# EAGLE design Emmelie-v3.2 (EAGLE 9.4.2)

## Sheet 1 of 3
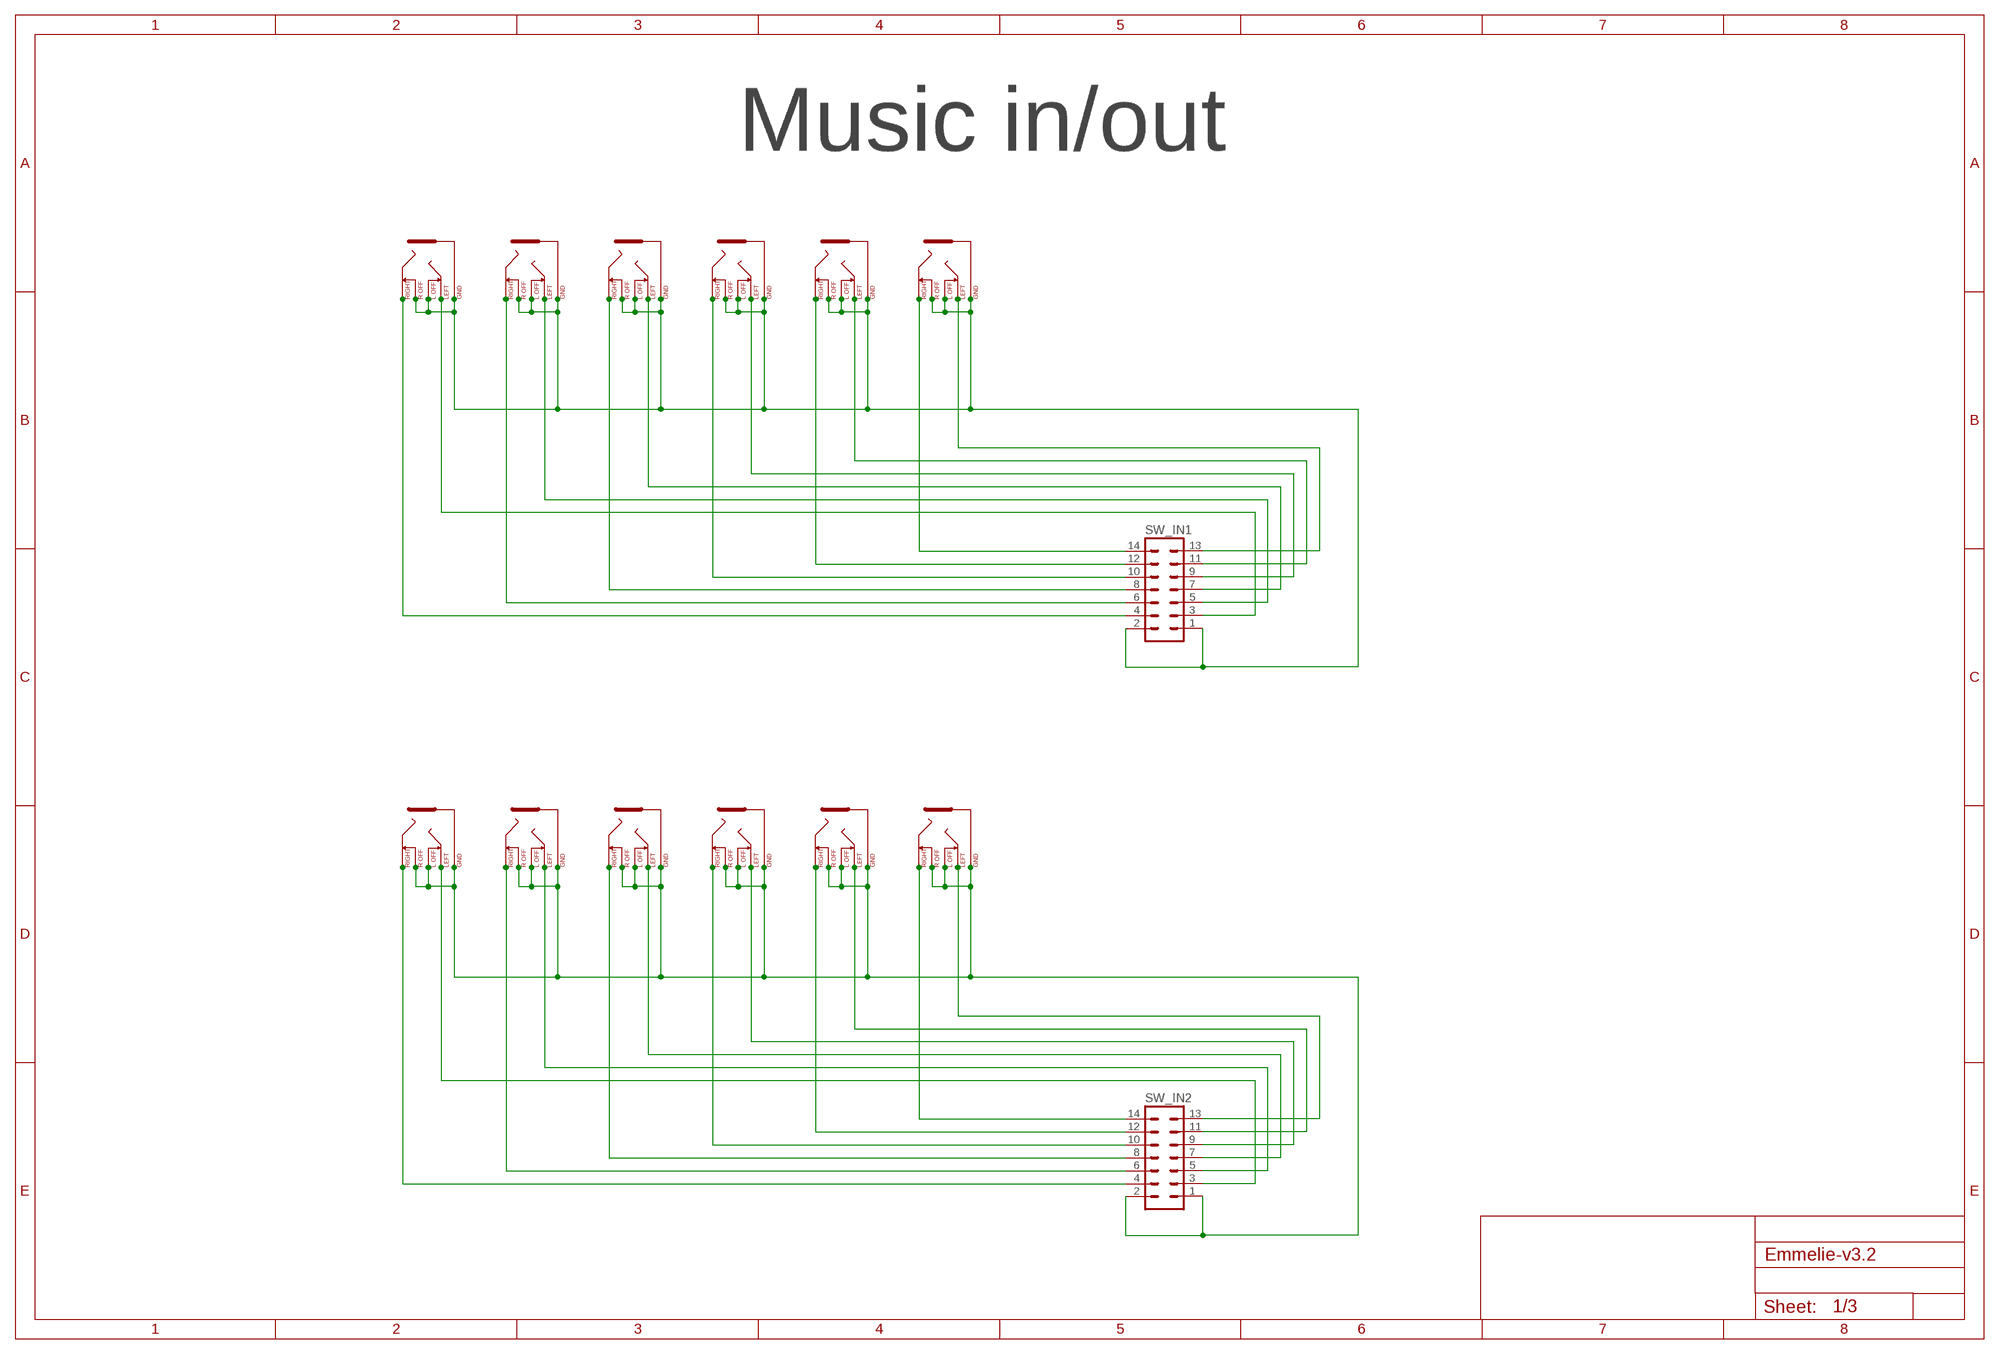
[diagram p0: schematic, sheet 1]

### Parts
SW_IN1  ML14  [ML14]
SW_IN2  ML14  [ML14]
U$1  KLINKE3,5  [KLINKE3,5]
U$2  KLINKE3,5  [KLINKE3,5]
U$3  KLINKE3,5  [KLINKE3,5]
U$4  KLINKE3,5  [KLINKE3,5]
U$5  KLINKE3,5  [KLINKE3,5]
U$6  KLINKE3,5  [KLINKE3,5]
U$7  KLINKE3,5  [KLINKE3,5]
U$8  KLINKE3,5  [KLINKE3,5]
U$9  KLINKE3,5  [KLINKE3,5]
U$10  KLINKE3,5  [KLINKE3,5]
U$11  KLINKE3,5  [KLINKE3,5]
U$12  KLINKE3,5  [KLINKE3,5]

### Nets
KLINKE_IN_0V: SW_IN2.1 SW_IN2.2 U$7.GND U$7.LEFT_OFF U$7.RIGHT_OFF U$8.GND U$8.LEFT_OFF U$8.RIGHT_OFF U$9.GND U$9.LEFT_OFF U$9.RIGHT_OFF U$10.GND U$10.LEFT_OFF U$10.RIGHT_OFF U$11.GND U$11.LEFT_OFF U$11.RIGHT_OFF U$12.GND U$12.LEFT_OFF U$12.RIGHT_OFF
KLINKE_OUT_0V: SW_IN1.1 SW_IN1.2 U$1.GND U$1.LEFT_OFF U$1.RIGHT_OFF U$2.GND U$2.LEFT_OFF U$2.RIGHT_OFF U$3.GND U$3.LEFT_OFF U$3.RIGHT_OFF U$4.GND U$4.LEFT_OFF U$4.RIGHT_OFF U$5.GND U$5.LEFT_OFF U$5.RIGHT_OFF U$6.GND U$6.LEFT_OFF U$6.RIGHT_OFF
N$27: SW_IN1.4 U$1.RIGHT
N$33: SW_IN1.6 U$2.RIGHT
N$34: SW_IN1.8 U$3.RIGHT
N$37: SW_IN1.10 U$4.RIGHT
N$38: SW_IN1.12 U$5.RIGHT
N$39: SW_IN1.14 U$6.RIGHT
N$40: SW_IN1.3 U$1.LEFT
N$41: SW_IN1.5 U$2.LEFT
N$42: SW_IN1.7 U$3.LEFT
N$43: SW_IN1.9 U$4.LEFT
N$44: SW_IN1.11 U$5.LEFT
N$45: SW_IN1.13 U$6.LEFT
N$46: SW_IN2.4 U$7.RIGHT
N$48: SW_IN2.6 U$8.RIGHT
N$49: SW_IN2.8 U$9.RIGHT
N$50: SW_IN2.10 U$10.RIGHT
N$51: SW_IN2.12 U$11.RIGHT
N$52: SW_IN2.14 U$12.RIGHT
N$53: SW_IN2.3 U$7.LEFT
N$54: SW_IN2.5 U$8.LEFT
N$55: SW_IN2.7 U$9.LEFT
N$61: SW_IN2.9 U$10.LEFT
N$62: SW_IN2.11 U$11.LEFT
N$87: SW_IN2.13 U$12.LEFT

### Notes on the sheet
- Music in/out

## Sheet 2 of 3
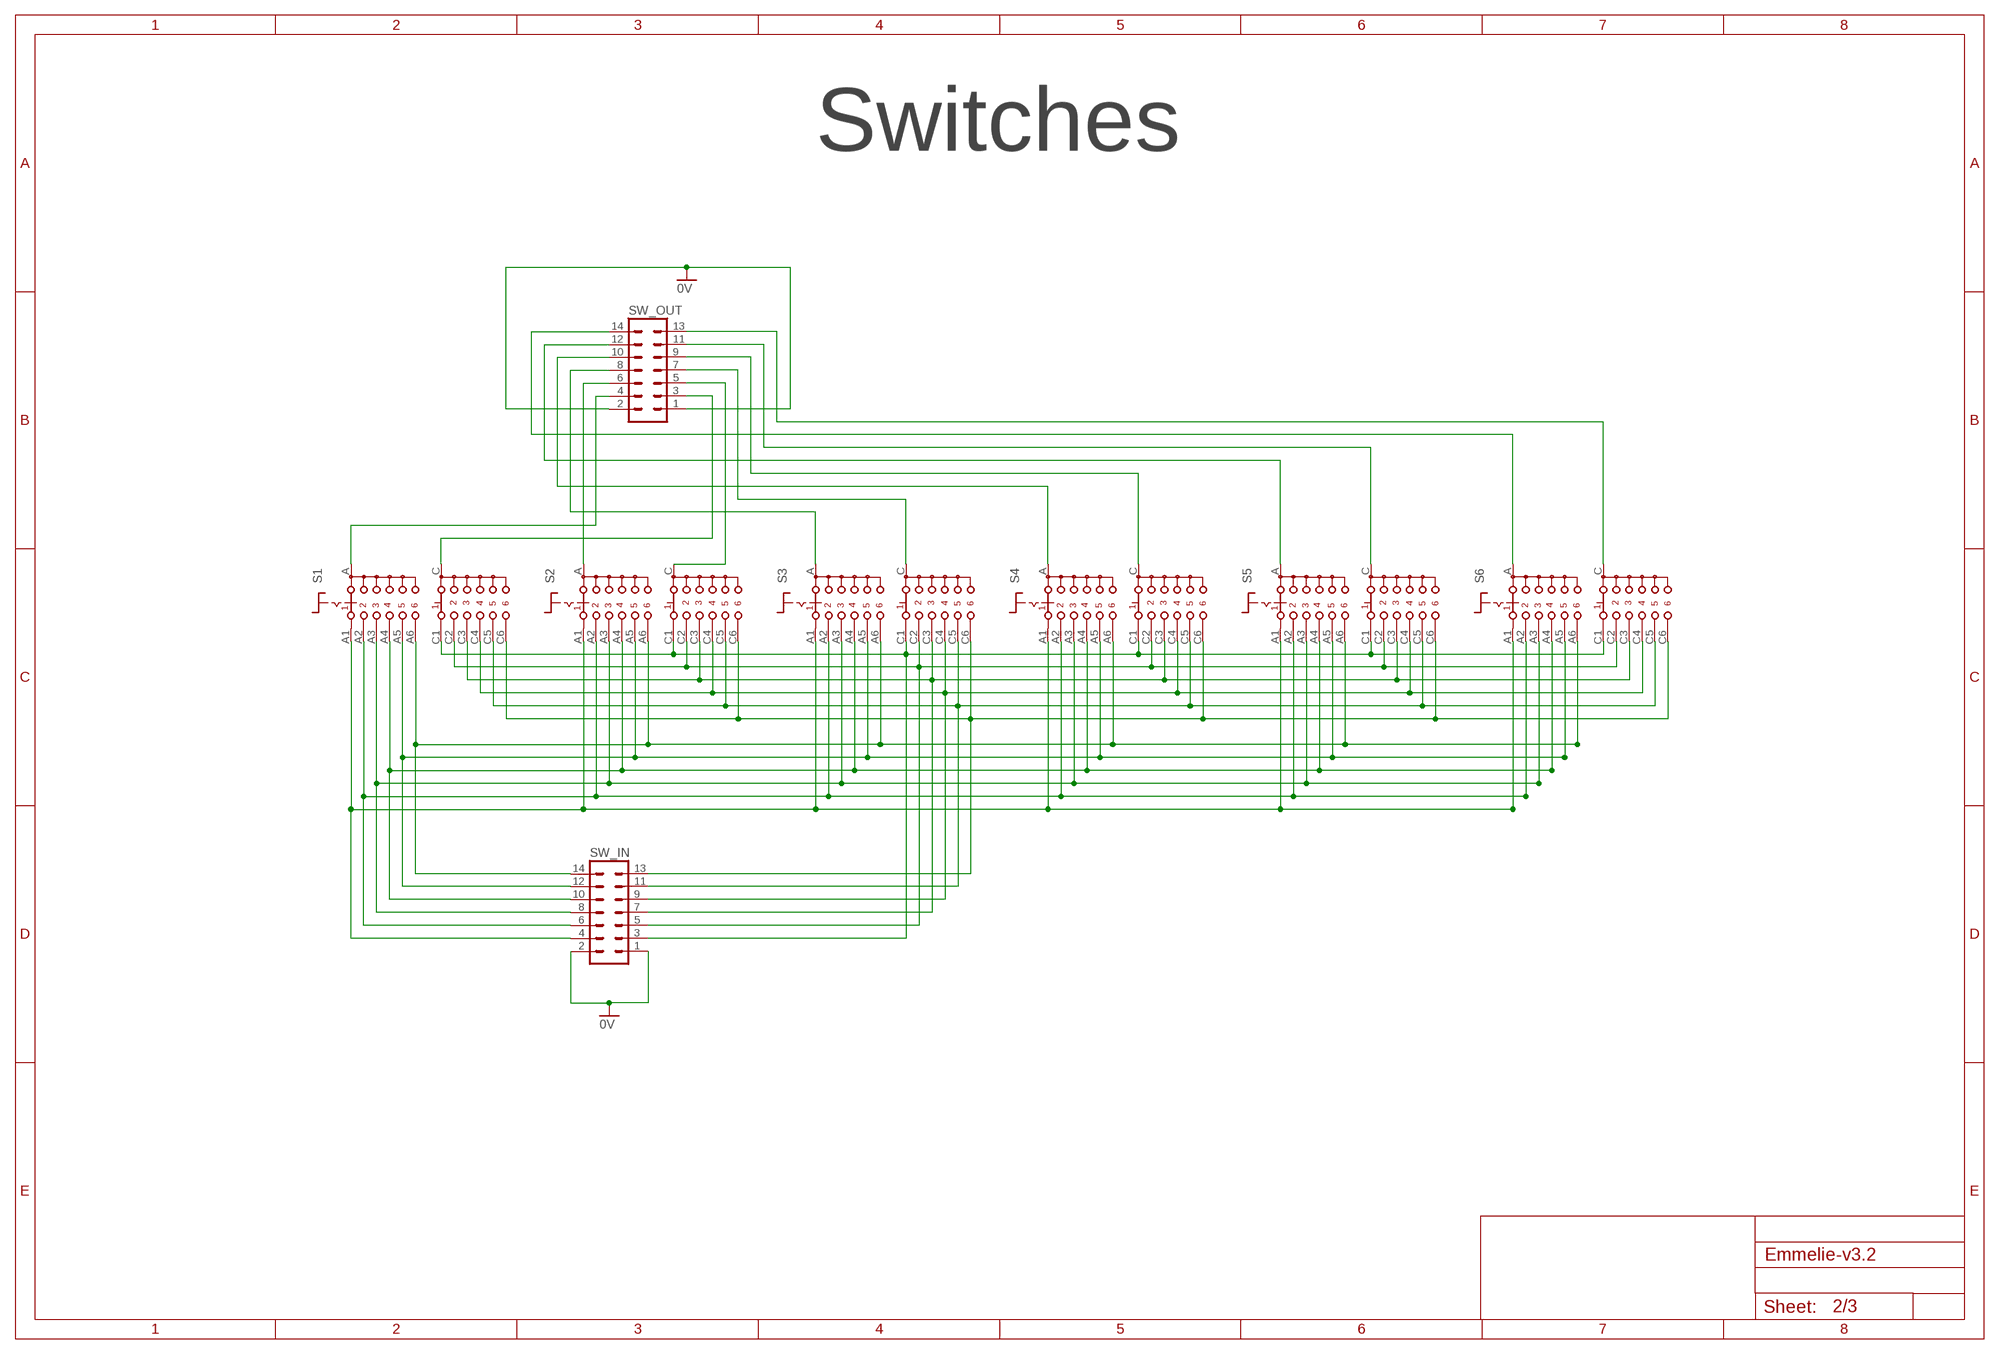
[diagram p1: schematic, sheet 2]

### Parts
S1  CK102X06  [CK102X06]
S2  CK102X06  [CK102X06]
S3  CK102X06  [CK102X06]
S4  CK102X06  [CK102X06]
S5  CK102X06  [CK102X06]
S6  CK102X06  [CK102X06]
SW_IN  ML14  [ML14]
SW_OUT  ML14  [ML14]

### Nets
N$1: S1.A1 S2.A1 S3.A1 S4.A1 S5.A1 S6.A1 SW_IN.4
N$2: S1.A2 S2.A2 S3.A2 S4.A2 S5.A2 S6.A2 SW_IN.6
N$3: S1.A3 S2.A3 S3.A3 S4.A3 S5.A3 S6.A3 SW_IN.8
N$4: S1.A4 S2.A4 S3.A4 S4.A4 S5.A4 S6.A4 SW_IN.10
N$5: S1.A5 S2.A5 S3.A5 S4.A5 S5.A5 S6.A5 SW_IN.12
N$6: S1.A6 S2.A6 S3.A6 S4.A6 S5.A6 S6.A6 SW_IN.14
N$7: S1.C SW_OUT.3
N$8: S1.A SW_OUT.4
N$9: S2.A SW_OUT.6
N$10: S2.C SW_OUT.5
N$11: S3.A SW_OUT.8
N$12: S3.C SW_OUT.7
N$19: S4.A SW_OUT.10
N$20: S4.C SW_OUT.9
N$21: S5.A SW_OUT.12
N$22: S5.C SW_OUT.11
N$23: S6.A SW_OUT.14
N$24: S6.C SW_OUT.13
N$25: S1.C1 S2.C1 S3.C1 S4.C1 S5.C1 S6.C1 SW_IN.3
N$56: S1.C2 S2.C2 S3.C2 S4.C2 S5.C2 S6.C2 SW_IN.5
N$57: S1.C3 S2.C3 S3.C3 S4.C3 S5.C3 S6.C3 SW_IN.7
N$58: S1.C4 S2.C4 S3.C4 S4.C4 S5.C4 S6.C4 SW_IN.9
N$59: S1.C5 S2.C5 S3.C5 S4.C5 S5.C5 S6.C5 SW_IN.11
N$60: S1.C6 S2.C6 S3.C6 S4.C6 S5.C6 S6.C6 SW_IN.13
SCHALTER_0V: SW_IN.1 SW_IN.2 SW_OUT.1 SW_OUT.2 ; supply symbol labelled 0V

### Notes on the sheet
- Switches

## Sheet 3 of 3
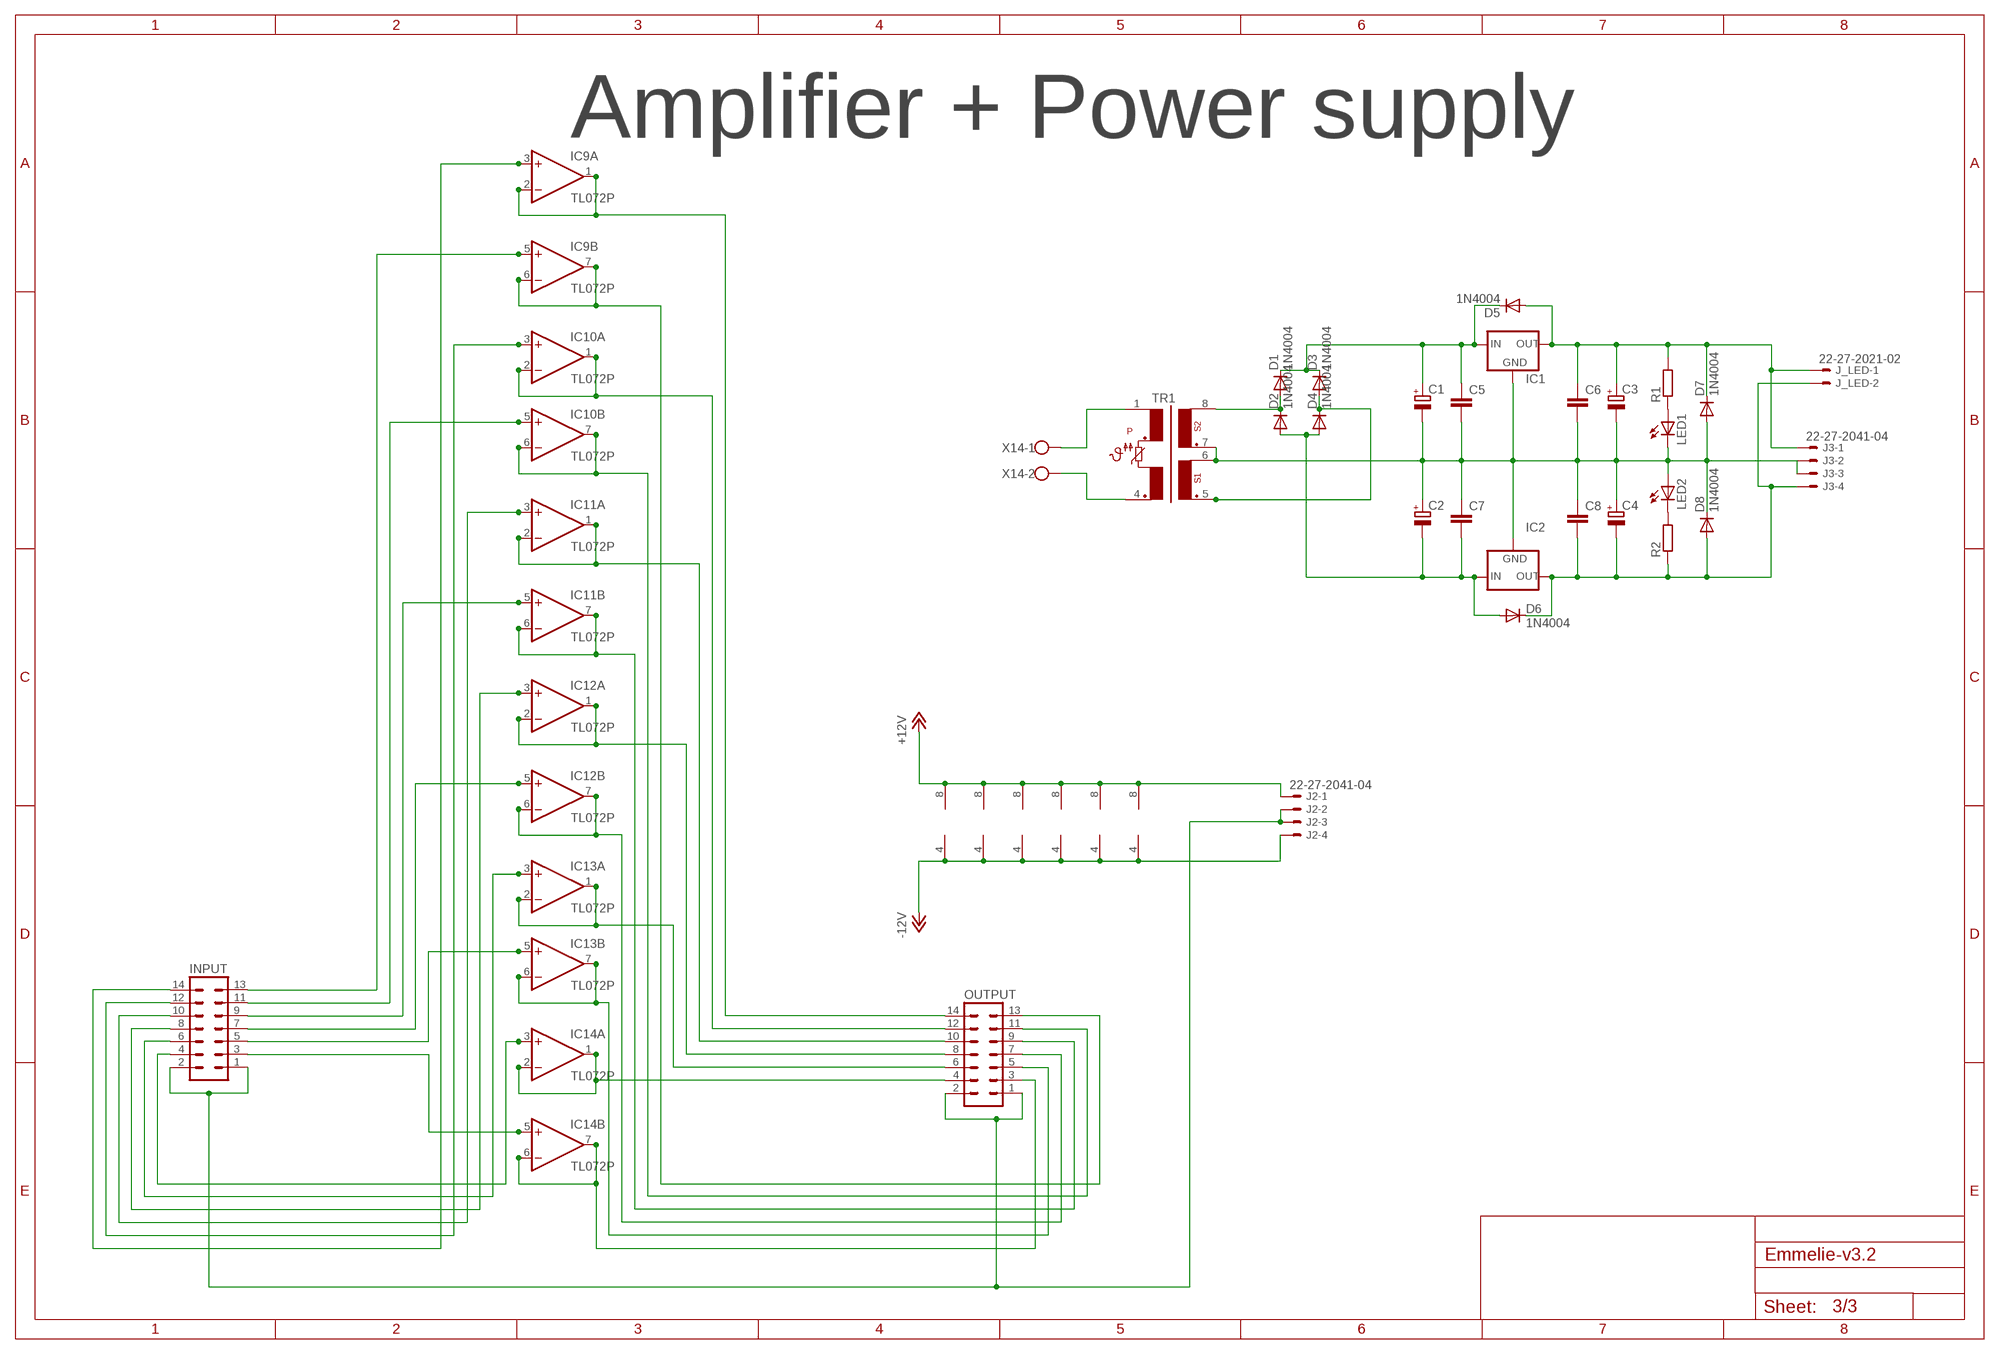
[diagram p2: schematic, sheet 3]

### Parts
C1  CPOL-EUE5-13  [E5-13]
C2  CPOL-EUE5-13  [E5-13]
C3  CPOL-EUE2.5-7  [E2,5-7]
C4  CPOL-EUE2.5-7  [E2,5-7]
C5  C-EU050-075X075  [C050-075X075]
C6  C-EU050-075X075  [C050-075X075]
C7  C-EU050-075X075  [C050-075X075]
C8  C-EU050-075X075  [C050-075X075]
D1  1N4004  [DO41-10]
D2  1N4004  [DO41-10]
D3  1N4004  [DO41-10]
D4  1N4004  [DO41-10]
D5  1N4004  [DO41-10]
D6  1N4004  [DO41-10]
D7  1N4004  [DO41-10]
D8  1N4004  [DO41-10]
IC1  78XXS  [78XXS]
IC2  79XXS  [79XXS]
IC9  TL072P  [DIL08]
IC10  TL072P  [DIL08]
IC11  TL072P  [DIL08]
IC12  TL072P  [DIL08]
IC13  TL072P  [DIL08]
IC14  TL072P  [DIL08]
INPUT  ML14  [ML14]
J2  22-27-2041-04  [6410-04]
J3  22-27-2041-04  [6410-04]
J_LED  22-27-2021-02  [6410-02]
LED1  LED5MM  [LED5MM]
LED2  LED5MM  [LED5MM]
OUTPUT  ML14  [ML14]
R1  R-EU_0207/15  [0207/15]
R2  R-EU_0207/15  [0207/15]
TR1  FLE04-06  [FLE04-06]
X14  W237-02P  [W237-132]

### Nets
+12V: IC9.8(P:V+) IC10.8(P:V+) IC11.8(P:V+) IC12.8(P:V+) IC13.8(P:V+) IC14.8(P:V+) J2.1
-12V: IC9.4(P:V-) IC10.4(P:V-) IC11.4(P:V-) IC12.4(P:V-) IC13.4(P:V-) IC14.4(P:V-) J2.4
N$13: C2.- C7.2 D2.A D4.A D6.A IC2.IN
N$14: D3.A D4.C TR1.5
N$16: C1.+ C5.1 D1.C D3.C D5.C IC1.IN
N$18: LED1.A R1.1
N$26: LED2.K(C) R2.2
N$31: TR1.1 X14.1
N$32: D1.A D2.C TR1.8
N$35: C3.+ C6.1 D5.A D7.C IC1.OUT J3.1 J_LED.1 R1.2
N$36: C4.- C8.2 D6.C D8.A IC2.OUT J3.4 J_LED.2 R2.1
N$63: IC14.5(B:+IN) INPUT.3
N$64: IC14.3(A:+IN) INPUT.4
N$65: IC13.3(A:+IN) INPUT.6
N$66: IC12.3(A:+IN) INPUT.8
N$67: IC9.3(A:+IN) INPUT.14
N$68: IC12.5(B:+IN) INPUT.7
N$69: IC10.3(A:+IN) INPUT.12
N$70: IC13.5(B:+IN) INPUT.5
N$71: IC11.5(B:+IN) INPUT.9
N$72: IC11.3(A:+IN) INPUT.10
N$73: IC10.5(B:+IN) INPUT.11
N$74: IC9.5(B:+IN) INPUT.13
N$75: IC14.6(B:-IN) IC14.7(B:OUT) OUTPUT.3
N$76: IC14.1(A:OUT) IC14.2(A:-IN) OUTPUT.4
N$77: IC13.6(B:-IN) IC13.7(B:OUT) OUTPUT.5
N$78: IC13.1(A:OUT) IC13.2(A:-IN) OUTPUT.6
N$79: IC12.6(B:-IN) IC12.7(B:OUT) OUTPUT.7
N$80: IC12.1(A:OUT) IC12.2(A:-IN) OUTPUT.8
N$81: IC11.6(B:-IN) IC11.7(B:OUT) OUTPUT.9
N$82: IC11.1(A:OUT) IC11.2(A:-IN) OUTPUT.10
N$83: IC10.6(B:-IN) IC10.7(B:OUT) OUTPUT.11
N$84: IC10.1(A:OUT) IC10.2(A:-IN) OUTPUT.12
N$85: IC9.6(B:-IN) IC9.7(B:OUT) OUTPUT.13
N$86: IC9.1(A:OUT) IC9.2(A:-IN) OUTPUT.14
N$89: TR1.4 X14.2
NETZ_0V: C1.- C2.+ C3.- C4.+ C5.2 C6.2 C7.1 C8.1 D7.A D8.C IC1.GND IC2.GND J3.2 J3.3 LED1.K(C) LED2.A TR1.6 TR1.7
OPV_0V: INPUT.1 INPUT.2 J2.2 J2.3 OUTPUT.1 OUTPUT.2

### Notes on the sheet
- Amplifier + Power supply

## Library data of the parts
C1 C2 = resistor:CPOL-EU: POLARIZED CAPACITOR, European symbol
C3 C4 = rcl:CPOL-EU: POLARIZED CAPACITOR, European symbol
C5-C8 = resistor:C-EU: CAPACITOR, European symbol
D1-D8 = diode:1N4004: DIODE general purpose rectifier, 1 A
IC1 = v-reg:78XXS: VOLTAGE REGULATOR
IC2 = v-reg:79XXS: VOLTAGE REGULATOR
IC9-IC14 = linear:TL072: OP AMP
INPUT OUTPUT SW_IN SW_IN1 SW_IN2 SW_OUT = con-ml:ML14: HARTING
J2 J3 = con-molex:22-?-04: CONNECTOR wire to board 2.54 mm (.1 inch) pitch header
J_LED = con-molex:22-?-02: CONNECTOR wire to board 2.54 mm (.1 inch) pitch header
LED1 LED2 = led:LED: LED OSRAM: - CHIPLED LG R971, LG N971, LY N971, LG Q971, LY Q971, LO R971, LY R971 LH N974, LH R974 LS Q976, LO Q976, LY Q976 LO Q996 - Hyper CHIPLED LW Q18S LB Q993, LB Q99A, LB R99A - SideLED LS A670, LO A670, LY A670, LG A670, LP A670 LB A673, LV A673, LT A673, LW A673 LH A674 LY A675 LS A676, LA A676, LO A676, LY A676, LW A676 LS A679, LY A679, LG A679 - Hyper Micro SIDELED® LS Y876, LA Y876, LO Y876, LY Y876 LT Y87S - SmartLED LW L88C, LW L88S LB L89C, LB L89S, LG L890 LS L89K, LO L89K, LY L89K LS L896, LA L896, LO L896, LY L896 - TOPLED LS T670, LO T670, LY T670, LG T670, LP T670 LSG T670, LSP T670, LSY T670, LOP T670, LYG T670 LG T671, LOG T671, LSG T671 LB T673, LV T673, LT T673, LW T673 LH T674 LS T676, LA T676, LO T676, LY T676, LB T676, LH T676, LSB T676, LW T676 LB T67C, LV T67C, LT T67C, LS T67K, LO T67K, LY T67K, LW E67C LS E67B, LA E67B, LO E67B, LY E67B, LB E67C, LV E67C, LT E67C LW T67C LS T679, LY T679, LG T679 LS T770, LO T770, LY T770, LG T770, LP T770 LB T773, LV T773, LT T773, LW T773 LH T774 LS E675, LA E675, LY E675, LS T675 LS T776, LA T776, LO T776, LY T776, LB T776 LHGB T686 LT T68C, LB T68C - Hyper Mini TOPLED® LB M676 - Mini TOPLED Santana® LG M470 LS M47K, LO M47K, LY M47K Source: http://www.osram.convergy.de LUXEON: - LUMILED® LXK2-PW12-R00, LXK2-PW12-S00, LXK2-PW14-U00, LXK2-PW14-V00 LXK2-PM12-R00, LXK2-PM12-S00, LXK2-PM14-U00 LXK2-PE12-Q00, LXK2-PE12-R00, LXK2-PE12-S00, LXK2-PE14-T00, LXK2-PE14-U00 LXK2-PB12-K00, LXK2-PB12-L00, LXK2-PB12-M00, LXK2-PB14-N00, LXK2-PB14-P00, LXK2-PB14-Q00 LXK2-PR12-L00, LXK2-PR12-M00, LXK2-PR14-Q00, LXK2-PR14-R00 LXK2-PD12-Q00, LXK2-PD12-R00, LXK2-PD12-S00 LXK2-PH12-R00, LXK2-PH12-S00 LXK2-PL12-P00, LXK2-PL12-Q00, LXK2-PL12-R00 Source: www.luxeon.com KINGBRIGHT: KA-3528ASYC Source: www.kingbright.com
R1 R2 = resistor:R-EU_: RESISTOR, European symbol
S1-S6 = switch:CK102X06: ROTARY SWITCH C&K
TR1 = trafo:FLE04-06: TRANSFORMER 2 primary winding, temp. protection fuse, 2 secondary windings, mounting holes BLOCK
U$1-U$12 = Mario - Klinke Stecker 3,5:KLINKE3,5: Reichelt: EBS 35 - 3,5 Klinke (by Mario Hesse)
X14 = con-wago-508:W237-02P: WAGO SREW CLAMP

## Board
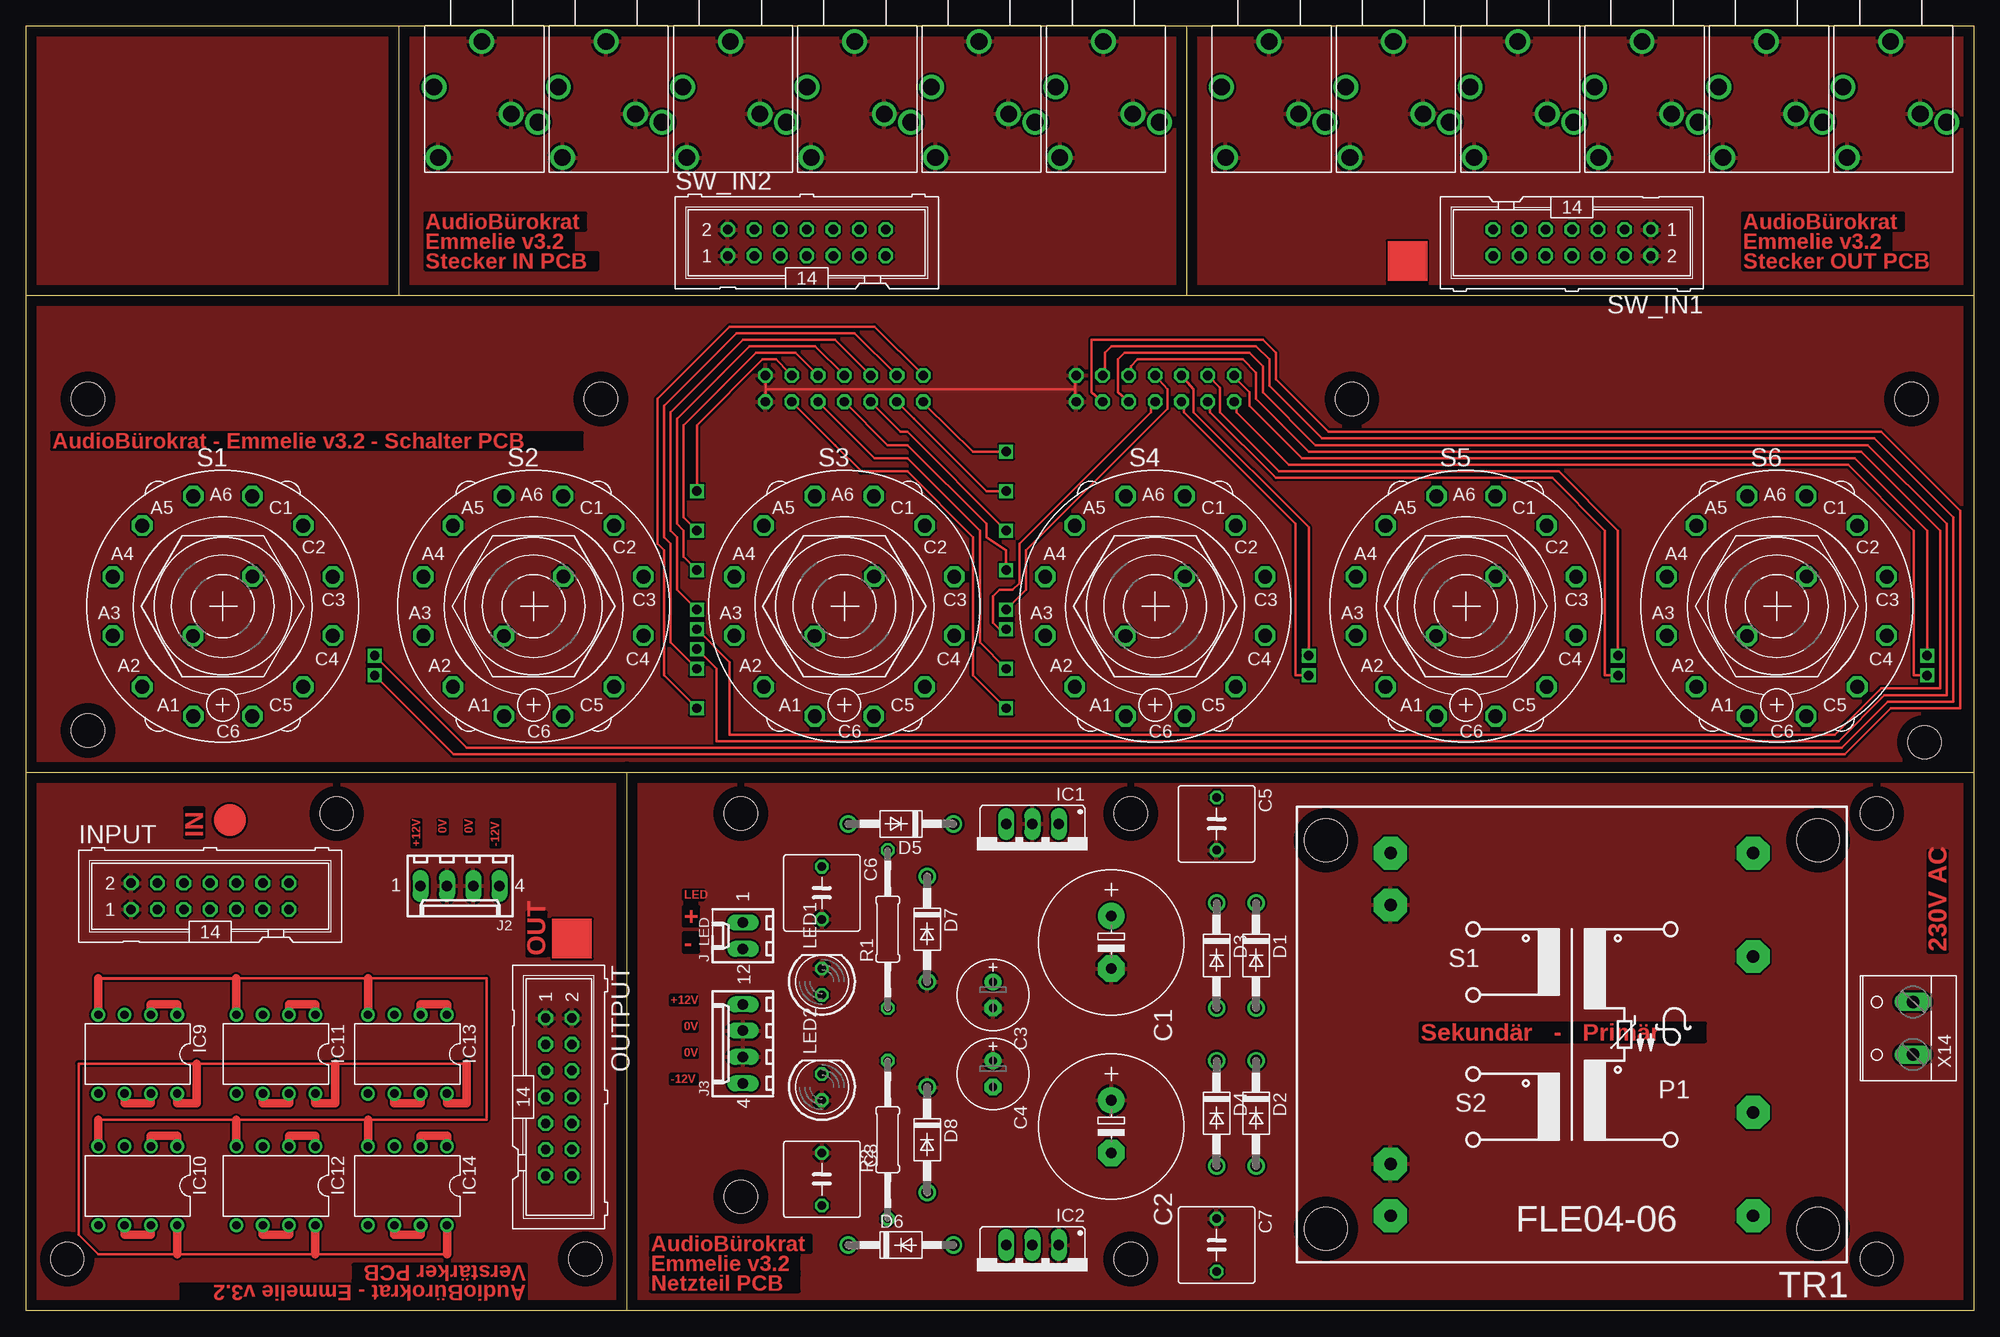
[diagram p3: board, top side]
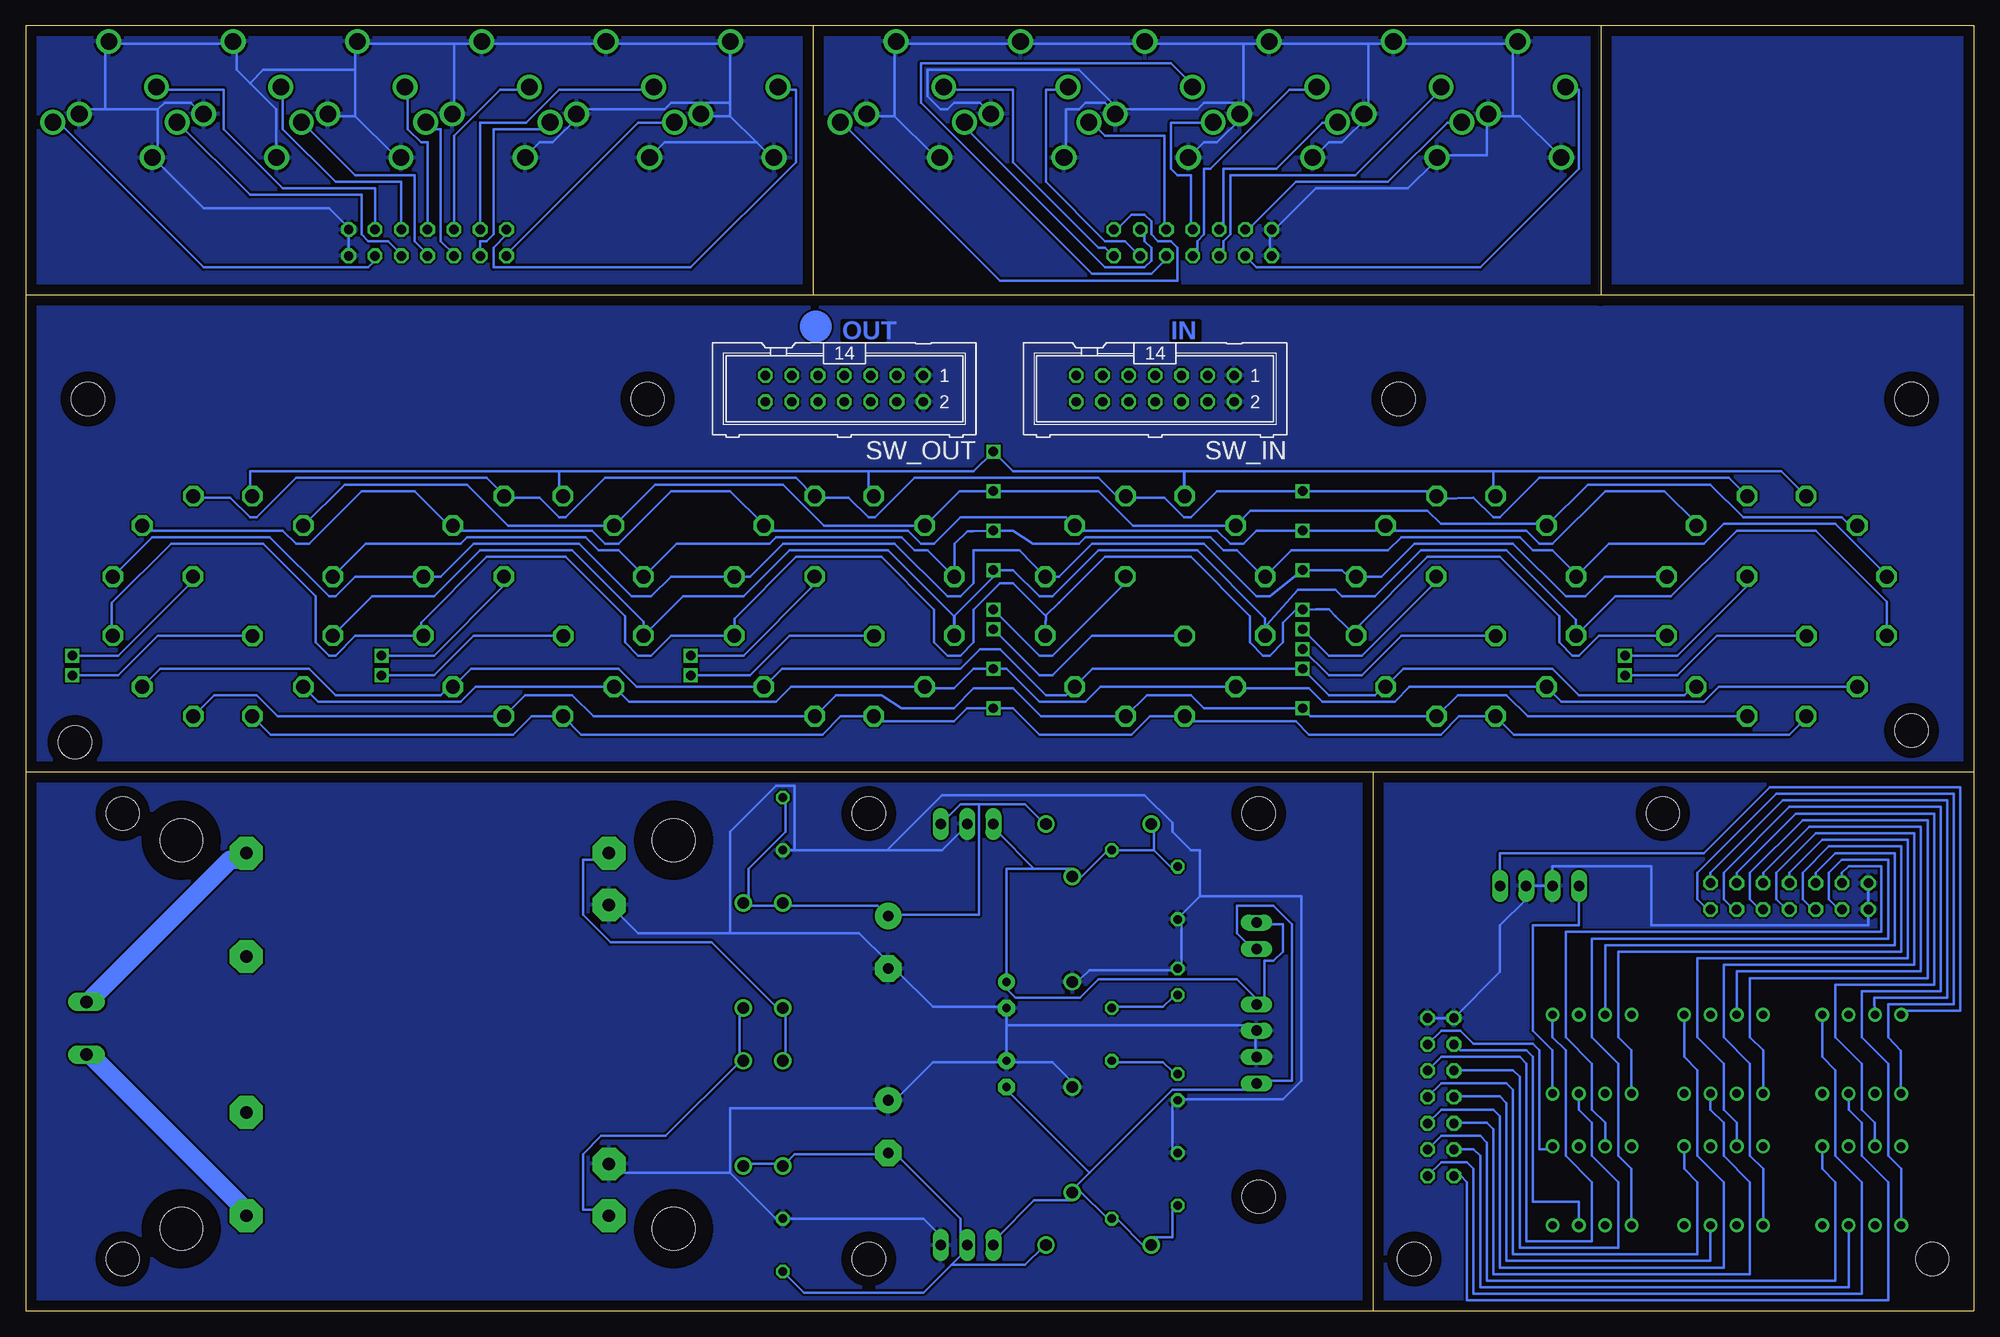
[diagram p4: board, bottom side, seen from below]

Size 188 x 124 mm. Coordinates in mm from the lower left corner, seen from the top.
Outline: 0,98 0,52
Outline: 188,52 188,0 58,0
Outline: 58,0 0,0 0,52
Outline: 0,52 58,52
Outline: 58,52 188,52
Outline: 58,52 58,0
Outline: 0,98 112,98
Outline: 112,98 187.96,98
Outline: 112,124 188,124 188,52
Outline: 0,98 0,124 36,124
Outline: 36,124 112,124
Outline: 112,124 112,98
Outline: 36,124 36,98
Copper layers (1*16): Top 0.035mm / dielectric 1.5mm / Bottom 0.035mm
Design rules "default *": minimum track width 10mil, minimum drill 24mil, track to track 8mil, track to pad 8mil, pad to pad 8mil, via to via 8mil, smd to smd 8mil, copper to edge 40mil, drill to drill 8mil, minimum pad ring 10mil, minimum via ring 8mil, stop-mask expansion 4mil, vias tented up to drill 0mil, thermal gap 10mil
Holes 3.2 mm at 30,48 4,5 54,5 69,11 69,48 106.65,48 178.65,48 106.65,5 178.65,5 6,56 6,88 182,88 183.27,54.87 128,88 55.5,88

### Footprints (pad centres in the part's own frame; a part is rotated, then mirrored left to right if it is on the bottom)
E5-13 = drill 1.016 pad 2.54: + -2.54,0 | drill 1.016 pad 2.54 octagon: - 2.54,0
E2,5-7 = drill 0.813 pad 1.6: + -1.27,0 | drill 0.813 pad 1.6 octagon: - 1.27,0
C050-075X075 = drill 0.813 octagon: 1 -2.54,0; 2 2.54,0
DO41-10 = drill 1.118: A 5.08,0; C -5.08,0
78XXS = drill 1.016 long: GND 0,-2.54; IN -2.54,-2.54; OUT 2.54,-2.54
79XXS = drill 1.016 long: GND -2.54,-2.54; IN 0,-2.54; OUT 2.54,-2.54
DIL08 = drill 0.813 pad 1.27: 1 -3.81,-3.81; 2 -1.27,-3.81; 3 1.27,-3.81; 4 3.81,-3.81; 5 3.81,3.81; 6 1.27,3.81; 7 -1.27,3.81; 8 -3.81,3.81
ML14 = drill 0.914 octagon: 1 -7.62,-1.27; 2 -7.62,1.27; 3 -5.08,-1.27; 4 -5.08,1.27; 5 -2.54,-1.27; 6 -2.54,1.27; 7 0,-1.27; 8 0,1.27; 9 2.54,-1.27; 10 2.54,1.27; 11 5.08,-1.27; 12 5.08,1.27; 13 7.62,-1.27; 14 7.62,1.27
6410-04 = drill 1.016 long: 1 3.81,0; 2 1.27,0; 3 -1.27,0; 4 -3.81,0
6410-02 = drill 1.016 long: 1 1.27,0; 2 -1.27,0
LED5MM = drill 0.813 octagon: A -1.27,0; K 1.27,0
0207/15 = drill 0.813 octagon: 1 -7.62,0; 2 7.62,0
CK102X06 = drill 1.321 octagon: A -2.87,-2.87; A1 -2.845,-10.617; A2 -7.772,-7.772; A3 -10.617,-2.845; A4 -10.617,2.845; A5 -7.772,7.772; A6 -2.845,10.617; C 2.87,2.87; C1 2.845,10.617; C2 7.772,7.772; C3 10.617,2.845; C4 10.617,-2.845; C5 7.772,-7.772; C6 2.845,-10.617
FLE04-06 = drill 1.194 pad 3.175 octagon: 1 -17.501,17.501; 2 -17.501,7.518; 3 -17.501,-7.518; 4 -17.501,-17.501; 5 17.501,-17.501; 6 17.501,-12.497; 7 17.501,12.497; 8 17.501,17.501 | hole 4.115: 23.749,18.745; 23.749,-18.745; -23.774,-18.745; -23.774,18.745
KLINKE3,5 = drill 1.6: GND 0,-1.5; LEFT -4.6,-5.9; LEFT_OFF -4.2,-12.7; RIGHT 5.4,-9.3; RIGHT_OFF 2.85,-8.5
W237-132 = drill 1.194 long: 1 -2.54,-0.635; 2 2.54,-0.635

### Placement (x,y rotation side)
C1  104.78,35.56 270 top
C2  104.78,17.78 270 top
C3  93.34,30.48 270 top
C4  93.34,22.86 270 top
C5  114.94,46.99 270 top
C6  76.83,40.33 270 top
C7  114.94,6.36 270 top
C8  76.83,12.7 270 top
D1  118.75,34.3 270 top
D2  118.75,19.06 270 top
D3  114.94,34.3 270 top
D4  114.94,19.06 270 top
D5  84.45,46.99 180 top
D6  84.45,6.36 0 top
D7  87,36.84 270 top
D8  87,16.52 270 top
IC1  97.16,44.45 180 top
IC2  97.16,3.81 180 top
IC9  10.79,24.77 180 top
IC10  10.79,12.07 180 top
IC11  24.13,24.77 180 top
IC12  24.13,12.07 180 top
IC13  36.83,24.77 180 top
IC14  36.83,12.07 180 top
INPUT  17.78,40.01 0 top
J2  41.91,41.01 180 top
J3  69.22,25.77 90 top
J_LED  69.22,36.2 90 top
LED1  76.83,31.76 90 top
LED2  76.83,21.59 90 top
OUTPUT  51.44,20.64 270 top
R1  83.19,36.84 90 top
R2  83.19,16.52 90 top
S1  19,68 0 top
S2  49,68 0 top
S3  79,68 0 top
S4  109,68 0 top
S5  139,68 0 top
S6  169,68 0 top
SW_IN  79,89 180 bottom
SW_IN1  149.22,103.08 180 top
SW_IN2  75.37,103.08 0 top
SW_OUT  109,89 180 bottom
TR1  149.22,26.67 180 top
U$1  180,124 0 top
U$2  168,124 0 top
U$3  156,124 0 top
U$4  144,124 0 top
U$5  132,124 0 top
U$6  120,124 0 top
U$7  44,124 0 top
U$8  56,124 0 top
U$9  68,124 0 top
U$10  80,124 0 top
U$11  92,124 0 top
U$12  104,124 0 top
U$13  [A4L-LOC]  -36,-32 0 top  (outside the outline)
X14  181.51,27.27 90 top

### Tracks (layer width: path | path; a pad name or v marks a point on that pad's centre or on a via)
+12V
  Top 0.254: 40.64,5.45 27.94,5.45 14.61,5.45 6.99,5.45 5.08,7.36 5.08,23.86 16.51,23.86 29.84,23.86 42.55,23.86
  Top 0.813: 40.64,5.45 IC14.8 | 27.94,5.45 IC12.8 | 14.61,5.45 IC10.8 | 16.51,23.86 16.51,20.06 14.61,20.06 IC9.8 | IC11.8 27.94,20.06 29.84,20.06 29.84,23.86 | IC13.8 40.64,20.06 42.55,20.06 42.55,23.86
  Bottom 0.254: IC13.8 40.64,25.13 42.55,27.04 42.55,37.2 38.1,37.2 J2.1
-12V
  Top 0.254: 6.99,18.47 20.32,18.47 33.02,18.47 44.45,18.47 44.45,32.12 33.02,32.12 20.32,32.12
  Top 0.305: 6.99,32.12 20.32,32.12
  Top 0.813: IC9.4 6.99,32.12 | 20.32,32.12 IC11.4 | 33.02,32.12 IC13.4 | 6.99,18.47 IC10.4 | 20.32,18.47 IC12.4 | 33.02,18.47 IC14.4
  Bottom 0.254: IC9.4 6.71,28.85 6.71,28.95 1.27,28.95 1.27,50.53 19.68,50.53 26.04,44.19 45.72,44.19 J2.4
KLINKE_IN_0V
  Bottom 0.254: 44.45,115.31 46.35,115.31 U$7.RIGHT_OFF 46.99,115.31 46.99,111.5 51.44,111.5 U$8.LEFT_OFF 52.07,110.86 54.61,108.32 63.5,108.32 67.31,104.51 SW_IN2.2 67.94,103.88 67.94,101.97 SW_IN2.1 | 44.45,115.31 43.81,115.31 40.01,111.5 U$7.LEFT_OFF | 44.45,115.31 44.45,122.29 | 104.14,115.31 100.33,111.5 U$12.LEFT_OFF | 104.14,115.31 106.68,115.31 U$12.RIGHT_OFF | 104.14,115.31 104.14,122.29 U$12.GND 103.5,122.29 92.08,122.29 U$11.GND 91.44,122.29 80.01,122.29 U$10.GND 79.38,122.29 70.48,122.29 | U$11.LEFT_OFF 87.63,111.5 87.63,115.94 86.36,115.94 85.72,116.58 83.82,116.58 83.19,115.94 U$10.RIGHT_OFF 82.55,115.94 | 82.55,115.94 86.36,119.75 100.97,119.75 100.97,117.21 99.69,115.94 99.06,115.94 98.42,116.58 95.89,116.58 95.25,115.94 U$11.RIGHT_OFF | 58.42,122.29 58.42,115.94 U$8.RIGHT_OFF 58.42,115.31 60.96,112.77 62.23,112.77 63.5,111.5 U$9.LEFT_OFF | 58.42,122.29 56.52,122.29 U$8.GND 55.88,122.29 44.45,122.29 | 70.48,122.29 70.48,116.58 | 70.48,116.58 70.48,115.94 U$9.RIGHT_OFF | 70.48,122.29 68.58,122.29 U$9.GND 67.94,122.29 58.42,122.29 | U$10.LEFT_OFF 75.56,111.5 74.3,112.77 73.03,112.77 70.48,115.31 U$9.RIGHT_OFF | 82.55,115.94 74.93,115.94 74.3,116.58 70.48,116.58 | 70.48,116.58 U$9.RIGHT_OFF | 44.45,122.29 U$7.GND
  pour Top: 36,124 112,124 112,98 36,98
  pour Bottom: 36,124 112,124 112,98 36,98
KLINKE_OUT_0V
  Bottom 0.254: 175.26,115.94 174.62,116.58 172.09,116.58 171.45,115.94 U$2.RIGHT_OFF | 180.34,115.94 182.25,115.94 U$1.RIGHT_OFF | 180.34,115.94 175.26,115.94 | 180.34,115.94 180.34,122.29 U$1.GND 179.71,122.29 168.28,122.29 U$2.GND 167.64,122.29 167.64,119.75 166.37,118.48 | SW_IN1.2 SW_IN1.1 156.84,104.51 158.75,106.41 170.81,106.41 175.26,110.86 U$1.LEFT_OFF 175.26,111.5 175.26,115.94 | U$4.LEFT_OFF 139.7,111.5 138.43,112.77 137.16,112.77 134.62,115.31 U$5.RIGHT_OFF 134.62,115.94 126.36,115.94 125.73,116.58 120.02,116.58 | 117.47,112.77 120.02,115.31 | 117.47,112.77 116.2,111.5 U$6.LEFT_OFF | 120.02,115.31 122.56,115.31 U$6.RIGHT_OFF | 117.47,112.77 126.36,112.77 127.64,111.5 U$5.LEFT_OFF | 120.02,115.31 120.02,116.58 | 120.02,116.58 120.02,122.29 | 146.69,122.29 146.69,115.94 U$4.RIGHT_OFF | 146.69,122.29 144.15,122.29 U$4.GND 143.51,122.29 132.08,122.29 U$5.GND 131.44,122.29 120.02,122.29 | 166.37,118.48 163.83,115.94 163.83,111.5 U$2.LEFT_OFF | 156.21,115.31 152.4,111.5 U$3.LEFT_OFF | 156.21,115.31 158.75,115.31 U$3.RIGHT_OFF | 156.21,119.75 156.21,115.31 | 156.21,119.75 156.21,122.29 U$3.GND 155.57,122.29 146.69,122.29 | 166.37,118.48 165.1,119.75 156.21,119.75 | 120.02,122.29 U$6.GND
  pour Top: 112,124 188,124 188,98 112,98
  pour Bottom: 112,124 188,124 188,98 112,98
N$1  (via drill 0.9)
  Top 0.254: SW_IN.4 78.09,83.56 80.64,81.02 85.09,81.02 91.44,74.66 91.44,61.33 v94.61,58.16
  Bottom 0.254: S1.A1 16.16,57.24 17.78,55.62 44.39,55.62 S2.A1 49.67,57.38 51.44,55.62 64.14,55.62 65.41,56.89 75.66,56.89 S3.A1 79.51,57.38 81.28,55.62 90.17,55.62 92.71,58.16 v94.61,58.16 97.16,58.16 98.42,56.89 105.41,56.89 106.29,57.52 S4.A1 109.36,57.38 111.12,55.62 134.39,55.62 S5.A1 139.2,57.38 140.97,55.62 164.39,55.62 S6.A1
N$2  (via drill 0.9)
  Top 0.254: SW_IN.6 81.91,82.28 85.09,82.28 92.08,75.3 92.08,64.5 v94.61,61.97
  Bottom 0.254: S1.A2 24.6,60.23 26.04,58.79 39.79,58.79 S2.A2 54.44,60.23 55.88,58.79 62.87,58.79 64.14,60.06 70.42,60.06 S3.A2 84.29,60.23 85.72,58.79 90.17,58.79 93.34,61.97 v94.61,61.97 96.52,61.97 98.42,60.06 101.06,60.06 S4.A2 114.13,60.23 115.57,58.79 129.79,58.79 S5.A2 144.61,60.23 146.05,58.79 159.79,58.79 S6.A2
N$3  (via drill 0.9)
  Top 0.254: SW_IN.8 83.17,83.56 85.09,83.56 92.71,75.94 92.71,74.66 94.61,73.39 v94.61,71.49
  Bottom 0.254: S1.A3 8.38,68.44 15.24,75.3 22.86,75.3 29.21,68.95 34.59,68.95 S2.A3 38.38,66.69 45.09,73.39 53.34,73.39 57.78,68.95 60.96,68.95 61.59,69.59 65.22,69.59 68.58,65.78 68.38,65.58 S3.A3 68.38,66.85 74.93,73.39 84.45,73.39 88.9,68.95 90.17,68.95 92.71,71.49 v94.61,71.49 94.59,70.86 94.61,70.86 98.42,67.05 | 98.42,67.05 S4.A3 98.38,67 98.42,67.05 | 98.42,67.05 104.78,73.39 114.3,73.39 118.75,68.95 124.59,68.95 S5.A3 128.38,66.52 135.25,73.39 144.15,73.39 148.59,68.95 154.59,68.95 S6.A3
N$4  (via drill 0.9)
  Top 0.254: SW_IN.10 84.44,84.83 85.09,84.83 v94.61,75.3
  Bottom 0.254: S1.A4 9.02,71.62 13.34,75.94 24.13,75.94 26.04,74.03 35.2,74.03 S2.A4 38.38,71.14 40.64,73.39 42.55,73.39 43.81,74.66 55.24,74.66 56.52,73.39 65.83,73.39 S3.A4 68.57,70.84 71.12,73.39 72.39,73.39 73.66,74.66 85.72,74.66 86.36,74.03 90.81,74.03 92.71,75.3 v94.61,75.3 96.57,75.25 97.1,75.25 98.37,74.03 S4.A4 98.42,70.84 100.97,73.39 102.23,73.39 103.5,74.66 115.57,74.66 116.2,74.03 125.2,74.03 S5.A4 128.38,70.97 130.81,73.39 132.72,73.39 133.99,74.66 145.41,74.66 146.05,74.03 155.2,74.03 S6.A4
N$5  (via drill 0.9)
  Top 0.254: SW_IN.12 85.72,86.09 92.71,79.11 v94.61,79.11
  Bottom 0.254: S1.A5 11.9,75.77 12.7,76.57 22.23,76.57 25.4,79.75 37.26,79.75 S2.A5 41.75,75.77 41.91,75.94 51.44,75.94 52.7,77.2 69.8,77.2 S3.A5 81.12,75.77 84.45,79.11 v94.61,79.11 97.89,79.11 S4.A5 110.96,75.77 114.94,79.75 127.25,79.75 S5.A5 141.44,75.77 145.41,79.75 157.25,79.75 S6.A5
N$6  (via drill 0.9)
  Top 0.254: SW_IN.14 86.89,87.36 91.44,82.92 v94.61,82.92
  Bottom 0.254: S1.A6 18.55,81.02 46.35,81.02 | 46.35,81.02 46.35,79.11 | 46.35,79.11 46.16,78.91 S2.A6 46.35,78.82 46.35,79.11 | 46.35,81.02 76.2,81.02 | 76.2,81.02 76.16,80.97 S3.A6 76.2,78.66 76.2,81.02 | 76.2,81.02 92.71,81.02 v94.61,82.92 96.52,81.02 106.68,81.02 | S4.A6 106.19,78.62 106.68,79.11 106.68,81.02 | 106.68,81.02 136.53,81.02 | 136.53,81.02 136.53,79.11 | 136.53,79.11 136.16,78.74 S5.A6 136.53,78.99 136.53,79.11 | 136.53,81.02 166.37,81.02 166.37,79.11 166.16,78.89 S6.A6
N$7  (via drill 0.9)
  Top 0.254: v33.66,63.23 42.55,54.34 175.29,54.34 179.71,58.79 186.06,58.79 186.06,76.57 178.44,84.19 125.09,84.19 120.02,89.27 120.02,91.81 118.75,93.08 104.78,93.08 104.14,92.44 104.14,90.54 SW_OUT.3
  Bottom 0.254: S1.C 21.87,69.94 28.57,63.23 v33.66,63.23
N$8  (via drill 0.9)
  Top 0.254: v33.66,61.33 41.27,53.71 175.58,53.71 180.02,58.16 186.69,58.16 186.69,77.2 179.07,84.83 125.73,84.83 120.65,89.91 120.65,92.44 119.38,93.72 102.87,93.72 102.87,88.64 SW_OUT.4
  Bottom 0.254: S1.A 24.77,65.13 28.57,61.33 v33.66,61.33
N$9  (via drill 0.9)
  Top 0.254: v64.77,63.87 66.67,61.97 66.67,54.98 174.98,54.98 179.39,59.42 185.42,59.42 185.42,75.94 177.8,83.56 124.46,83.56 119.38,88.64 119.38,91.17 118.11,92.44 106.05,92.44 105.41,91.81 105.41,88.64 SW_OUT.6
  Bottom 0.254: S2.A 55.26,65.13 59.05,61.33 62.23,61.33 v64.77,63.87
N$10  (via drill 0.9)
  Top 0.254: v64.77,65.78 67.94,62.6 67.94,55.62 174.62,55.62 179.07,60.06 184.78,60.06 184.78,75.3 177.16,82.92 123.83,82.92 118.75,88 118.75,90.54 117.47,91.81 107.31,91.81 106.68,91.17 106.68,90.54 106.46,90.32 SW_OUT.5
  Bottom 0.254: S2.C 51.87,70.42 59.05,63.23 62.23,63.23 v64.77,65.78
N$11  (via drill 0.9)
  Top 0.254: SW_OUT.8 108.58,87.36 108.58,86.73 95.89,74.03 95.89,70.22 95.25,69.59 93.98,69.59 93.34,68.95 93.34,66.41 93.98,65.78 v94.61,65.78
  Bottom 0.254: S3.A 85.1,65.13 88.9,61.33 90.17,61.33 v94.61,65.78
N$12  (via drill 0.9)
  Top 0.254: SW_OUT.7 110.17,88.95 110.17,87.05 96.52,73.39 96.52,69.59 v94.61,67.68
  Bottom 0.254: S3.C 81.87,70.27 88.9,63.23 90.17,63.23 v94.61,67.68
N$13
  Bottom 0.254: D2.A 118.24,14.21 115.57,14.21 D4.A 114.68,14.21 113.79,15.1 104.9,15.1 C2.- 104.01,15.1 97.79,8.88 97.79,7.1 IC2.IN 96.9,6.21 98.68,4.43 | 98.68,4.43 101.35,1.77 112.9,1.77 114.68,3.55 C7.2 | 98.68,4.43 91.57,4.43 89.79,6.21 D6.A
N$14
  Bottom 0.254: D4.C 114.68,24.88 114.68,28.44 D3.A 115.57,29.33 121.79,35.55 131.57,35.55 134.24,38.22 134.24,43.55 132.46,43.55 TR1.5
N$15
  pour Bottom: 0,124 36,124 36,98 0,98
  pour Top: 0,124 36,124 36,98 0,98
N$16
  Bottom 0.254: 96.01,48.88 91.57,48.88 89.79,47.11 D5.C | 96.01,48.88 97.79,48.88 99.57,47.11 IC1.IN | C5.1 114.68,48.88 114.68,46.22 118.24,42.66 118.24,39.99 D1.C 118.24,39.1 115.57,39.1 D3.C 114.68,39.1 105.79,39.1 104.9,38.22 C1.+ 104.01,38.22 96.01,38.22 96.01,48.88
N$18
  Bottom 0.254: LED1.A 77.34,30.22 78.23,29.33 82.68,29.33 R1.1
N$19  (via drill 0.9)
  Top 0.254: SW_OUT.10 111.76,87.36 111.76,86.73 122.56,75.94 122.56,61.33 v123.83,61.33
  Bottom 0.254: S4.A 114.31,65.13 118.11,61.33 v123.83,61.33
N$20  (via drill 0.9)
  Top 0.254: SW_OUT.9 112.71,88.95 112.71,86.73 123.83,75.62 v123.83,63.23
  Bottom 0.254: S4.C 111.87,70.11 118.75,63.23 v123.83,63.23
N$21  (via drill 0.9)
  Top 0.254: SW_OUT.12 114.3,87.51 114.3,86.73 120.65,80.38 147.32,80.38 152.4,75.3 152.4,61.33 v153.67,61.33
  Bottom 0.254: S5.A 144.79,65.13 148.59,61.33 v153.67,61.33
N$22  (via drill 0.9)
  Top 0.254: SW_OUT.11 115.25,89.1 115.25,86.73 120.97,81.02 147.96,81.02 153.67,75.3 v153.67,63.23
  Bottom 0.254: S5.C 141.87,69.95 148.59,63.23 v153.67,63.23
N$23  (via drill 0.9)
  Top 0.254: v183.51,61.33 182.25,61.33 182.25,75.3 175.9,81.65 121.92,81.65 116.84,86.73 116.84,87.36 SW_OUT.14
  Bottom 0.254: S6.A 175.27,65.13 179.07,61.33 v183.51,61.33
N$24  (via drill 0.9)
  Top 0.254: SW_OUT.13 116.98,89.91 116.98,89.76 118.11,88.64 118.11,87.36 123.19,82.28 176.53,82.28 183.51,75.3 v183.51,63.23
  Bottom 0.254: S6.C 171.87,70.44 179.07,63.23 v183.51,63.23
N$25  (via drill 0.9)
  Top 0.254: SW_IN.3 73.66,90.53 72.39,91.81 71.12,91.81 64.77,85.46 v64.77,79.11
  Bottom 0.254: S1.C1 23.61,80.38 41.91,80.38 45.72,76.57 46.35,76.57 48.26,78.47 51.44,78.39 S2.C1 52.21,78.62 52.7,79.11 v64.77,79.11 73.03,79.11 75.56,76.57 76.2,76.57 78.11,78.47 81.7,78.47 S3.C1 82.69,78.62 84.45,80.38 102.23,80.38 106.05,76.57 106.68,76.57 108.58,78.47 111.7,78.47 S4.C1 111.9,78.62 113.67,80.38 132.08,80.38 135.89,76.57 136.53,76.57 138.43,78.47 141.7,78.47 S5.C1 141.84,78.72 143.51,80.38 161.93,80.38 165.74,76.57 166.37,76.57 168.28,78.47 171.7,78.47 S6.C1
N$26
  Bottom 0.254: LED2.K 77.34,23.1 78.23,23.99 82.68,23.99 R2.2
N$27
  Bottom 0.254: SW_IN1.4 154.31,101.34 154.94,100.7 170.81,100.7 184.78,114.67 U$1.RIGHT
N$28
  pour Bottom: 83.19,96.25 79.38,96.25 81.28,93.08
N$30
  pour Top (isolate 0.254): 88.9,100.06 92.71,100.06 90.81,103.24
N$31
  Bottom 0.254: 181.61,24.5 X14.1 | TR1.1 166.37,9.26
  Bottom 1.778: 166.37,9.26 181.61,24.5
N$32
  Bottom 0.254: D1.A 119.13,28.44 119.13,24.88 D2.C 119.13,23.99 126.24,16.88 132.46,16.88 134.24,15.1 134.24,9.77 132.46,9.77 TR1.8
N$33
  Bottom 0.254: SW_IN1.6 151.76,101.97 153.03,103.24 154.94,103.24 155.57,103.88 155.57,107.69 166.37,107.69 173.35,114.67 U$2.RIGHT
N$34
  Bottom 0.254: SW_IN1.8 149.22,101.97 150.5,103.24 150.5,109.59 156.21,109.59 161.29,114.67 U$3.RIGHT
N$35
  Bottom 0.254: 79.12,44.44 77.34,42.66 C6.1 | 79.12,44.44 82.68,44.44 R1.2 83.57,44.44 86.23,41.77 D7.C 87.12,42.66 90.68,42.66 | 79.12,44.44 79.12,46.22 D5.A | J_LED.1 68.45,37.33 66.67,37.33 66.67,34.66 67.56,33.77 68.45,33.77 68.45,30.22 J3.1 69.34,30.22 71.12,31.99 84.45,31.99 86.23,30.22 92.46,30.22 93.34,31.1 C3.+ 93.34,42.66 90.68,42.66 | 90.68,42.66 94.23,46.22 IC1.OUT
N$36
  Bottom 0.254: C8.2 77.34,9.77 77.34,7.1 79.12,7.1 D6.C 80.01,6.21 82.68,8.88 R2.1 83.57,8.88 86.23,11.55 D8.A | 85.34,13.32 87.12,11.55 D8.A | 85.34,13.32 77.34,21.33 69.34,21.33 J3.4 68.45,22.21 65.79,22.21 65.79,37.33 67.56,39.1 71.12,39.1 71.12,36.44 70.23,35.55 69.34,35.55 J_LED.2 | IC2.OUT 94.23,7.1 90.68,10.66 87.12,10.66 D8.A | 85.34,13.32 93.34,21.33 C4.-
N$37
  Bottom 0.254: SW_IN1.10 146.69,101.97 147.96,103.24 147.96,114.03 148.59,114.03 149.22,114.67 U$4.RIGHT
N$38
  Bottom 0.254: SW_IN1.12 144.15,103.24 143.51,103.24 142.88,103.88 142.88,114.03 138.43,114.03 137.79,114.67 U$5.RIGHT
N$39
  Bottom 0.254: SW_IN1.14 141.6,101.97 128.91,114.67 125.73,114.67 U$6.RIGHT
N$40
  Bottom 0.254: SW_IN1.3 154.31,108.32 163.19,108.32 168.91,114.03 168.91,117.84 175.26,117.84 U$1.LEFT
N$41
  Bottom 0.254: SW_IN1.5 151.76,108.95 158.12,108.95 163.19,114.03 163.19,117.84 U$2.LEFT
N$42
  Bottom 0.254: SW_IN1.7 149.22,112.77 149.86,112.77 151.13,114.03 151.13,117.84 U$3.LEFT
N$43
  Bottom 0.254: SW_IN1.9 146.69,113.4 142.24,117.84 139.7,117.84 U$4.LEFT
N$44
  Bottom 0.254: SW_IN1.11 144.15,114.67 139.7,114.67 136.53,117.84 127.64,117.84 U$5.LEFT
N$45
  Bottom 0.254: SW_IN1.13 141.6,103.88 142.88,102.61 142.88,100.7 123.83,100.7 113.67,110.86 113.67,117.84 114.94,117.84 U$6.LEFT
N$46
  Bottom 0.254: SW_IN2.4 69.85,104.51 65.41,108.95 56.52,108.95 50.8,114.67 49.53,114.67 U$7.RIGHT
N$48
  Bottom 0.254: SW_IN2.6 72.39,104.51 72.39,110.22 67.31,110.22 62.87,114.67 61.59,114.67 U$8.RIGHT
N$49
  Bottom 0.254: SW_IN2.8 75.56,104.51 75.56,109.59 76.83,109.59 77.47,110.22 77.47,114.67 73.66,114.67 U$9.RIGHT
N$50
  Bottom 0.254: SW_IN2.10 78.11,104.51 78.11,113.4 83.82,113.4 85.09,114.67 U$10.RIGHT
N$51
  Bottom 0.254: SW_IN2.12 80.01,103.88 80.01,103.24 79.38,102.61 79.38,101.34 80.01,100.7 83.82,100.7 97.79,114.67 U$11.RIGHT
N$52
  Bottom 0.254: SW_IN2.14 82.55,104.51 81.28,105.78 80.01,105.78 79.38,105.14 79.38,103.88 78.74,103.24 77.47,103.24 76.83,102.61 76.83,99.43 93.98,99.43 109.22,114.67 U$12.RIGHT
N$53
  Bottom 0.254: SW_IN2.3 69.85,101.34 69.22,100.7 47.62,100.7 38.1,110.22 38.1,117.84 39.37,117.84 U$7.LEFT
N$54
  Bottom 0.254: SW_IN2.5 72.39,101.97 72.39,103.24 71.75,103.88 71.75,109.59 59.69,109.59 51.44,117.84 U$8.LEFT
N$55
  Bottom 0.254: SW_IN2.7 74.93,101.97 74.93,103.24 74.3,103.88 74.3,110.22 73.66,110.22 66.04,117.84 63.5,117.84 U$9.LEFT
N$56  (via drill 0.9)
  Top 0.254: SW_IN.5 74.28,92.44 70.48,92.44 63.5,85.46 63.5,76.57 v64.77,75.3
  Bottom 0.254: S1.C2 26.77,76.04 29.84,79.11 35.56,79.11 40.64,74.03 41.91,74.03 43.18,75.3 56.3,75.3 S2.C2 56.99,75.77 57.78,75.3 v64.77,75.3 69.22,75.3 70.48,74.03 71.75,74.03 73.03,75.3 86.3,75.3 S3.C2 86.83,75.77 87.63,76.57 97.79,76.57 100.33,74.03 101.6,74.03 102.87,75.3 116.3,75.3 S4.C2 116.77,75.87 120.02,79.11 125.73,79.11 130.81,74.03 132.08,74.03 133.35,75.3 146.3,75.3 S5.C2 147.16,75.77 150.5,79.11 155.57,79.11 160.66,74.03 161.93,74.03 163.19,75.3 176.3,75.3 S6.C2
N$57  (via drill 0.9)
  Top 0.254: SW_IN.7 76.19,93.08 69.85,93.08 62.87,86.09 62.87,75.94 63.5,75.3 63.5,72.76 v64.77,71.49
  Bottom 0.254: S1.C3 35.57,70.84 37.47,68.95 39.37,68.95 44.45,74.03 53.98,74.03 57.15,70.86 59.61,70.86 S2.C3 60.31,70.84 60.96,71.49 v64.77,71.49 v64.78,71.48 67.94,68.95 69.22,68.95 74.3,74.03 85.09,74.03 88.27,70.86 89.61,70.86 S3.C3 92.08,73.39 96.52,73.39 96.53,72.77 96.53,70.21 97.79,68.95 99.06,68.95 104.14,74.03 114.94,74.03 118.11,70.86 119.61,70.86 S4.C3 125.74,70.84 127.64,68.95 129.54,68.95 134.62,74.03 144.78,74.03 147.96,70.86 149.61,70.86 S5.C3 156.22,70.84 158.12,68.95 158.75,68.95 164.47,74.66 175.8,74.66 S6.C3
N$58  (via drill 0.9)
  Top 0.254: SW_IN.9 78.09,93.72 69.22,93.72 62.23,86.73 62.23,75.3 62.87,74.66 62.87,69.59 v64.77,67.68
  Bottom 0.254: S1.C4 36.18,65.16 38.1,63.23 38.73,63.23 40.01,64.5 40.01,67.05 45.72,72.76 52.7,72.76 59.69,65.78 59.69,65.23 S2.C4 61.59,67.05 62.24,67.69 63.48,67.69 v64.77,67.68 65.41,67.68 66.67,66.41 66.67,64.5 67.94,63.23 68.58,63.23 69.85,64.5 69.85,67.05 75.56,72.76 83.82,72.76 88.27,68.31 89.53,67.14 S3.C4 89.53,67.05 92.71,70.22 93.98,70.22 96.52,67.68 96.52,64.5 97.79,63.23 99.06,63.23 100.33,64.5 100.33,67.68 105.41,72.76 113.67,72.76 119.62,66.81 S4.C4 125.72,65.16 127.64,63.23 128.91,63.23 130.18,64.5 130.18,67.05 135.89,72.76 143.51,72.76 149.86,66.41 149.86,65.55 S5.C4 156.19,65.16 158.12,63.23 158.75,63.23 160.02,64.5 160.02,68.95 165.1,74.03 173.99,74.03 179.71,68.31 179.71,65.24 S6.C4
N$59  (via drill 0.9)
  Top 0.254: SW_IN.11 80,94.35 68.58,94.35 61.59,87.36 61.59,74.66 62.23,74.03 62.23,64.5 v64.77,61.97
  Bottom 0.254: S1.C5 27.14,60.23 27.94,59.42 38.1,59.42 40.64,61.97 55.03,61.97 S2.C5 56.98,60.23 57.78,59.42 62.23,59.42 v64.77,61.97 85.03,61.97 S3.C5 86.83,60.23 87.63,59.42 89.53,59.42 93.98,63.87 95.89,63.87 97.79,61.97 115.03,61.97 S4.C5 129.07,60.23 130.81,61.97 145.03,61.97 S5.C5 147.15,60.23 147.96,59.42 158.12,59.42 160.66,61.97 175.03,61.97 S6.C5
N$60  (via drill 0.9)
  Top 0.254: SW_IN.13 81.91,94.98 67.94,94.98 60.96,88 60.96,74.03 61.59,73.39 61.59,61.33 v64.77,58.16
  Bottom 0.254: S1.C6 43.04,57.38 45.09,59.42 49.8,59.42 S2.C6 64,57.38 v64.77,58.16 74.3,58.16 75.56,59.42 79.8,59.42 S3.C6 90.03,57.38 92.71,60.06 96.52,60.06 98.42,58.16 103.5,58.16 105.27,59.29 105.41,59.42 109.8,59.42 S4.C6 133.21,57.38 135.25,59.42 139.8,59.42 S5.C6 163.69,57.38 165.74,59.42 169.8,59.42 S6.C6
N$61
  Bottom 0.254: SW_IN2.9 78.11,101.34 79.38,100.06 85.09,100.06 101.6,116.58 101.6,120.38 77.47,120.38 75.56,118.48 U$10.LEFT
N$62
  Bottom 0.254: SW_IN2.11 80.64,101.97 81.92,103.24 83.82,103.24 89.53,108.95 89.53,117.84 87.63,117.84 U$11.LEFT
N$63
  Bottom 0.254: INPUT.3 12.7,38.47 13.97,39.74 13.97,42.28 12.7,43.55 8.26,43.55 8.26,35.93 36.83,35.93 36.83,26.41 34.29,23.86 34.29,14.97 33.02,13.7 IC14.5
N$64
  Bottom 0.254: INPUT.4 12.7,42.28 12.06,42.91 8.89,42.91 8.89,36.56 39.37,36.56 39.37,26.41 36.83,23.86 36.83,19.42 35.56,18.15 IC14.3
N$65
  Bottom 0.254: INPUT.6 15.24,42.28 13.34,44.19 7.62,44.19 7.62,35.3 35.56,35.3 IC13.3
N$66
  Bottom 0.254: INPUT.8 17.78,42.28 14.61,45.45 6.35,45.45 6.35,34.02 26.67,34.02 26.67,26.41 24.13,23.86 24.13,19.42 22.86,18.15 IC12.3
N$67
  Bottom 0.254: INPUT.14 25.4,42.28 18.41,49.27 2.54,49.27 2.54,30.22 9.57,30.22 IC9.3
N$68
  Bottom 0.254: INPUT.7 18.05,38.74 19.05,39.74 19.05,42.28 15.24,46.09 5.71,46.09 5.71,33.39 24.13,33.39 24.13,26.41 21.59,23.86 21.59,14.97 20.32,13.7 IC12.5
N$69
  Bottom 0.254: INPUT.12 22.86,42.28 17.14,47.99 3.81,47.99 3.81,31.48 13.34,31.48 13.34,26.41 10.79,23.86 10.79,19.42 9.53,18.15 IC10.3
N$70
  Bottom 0.254: INPUT.5 15.24,38.47 16.51,39.74 16.51,42.28 13.97,44.82 6.99,44.82 6.99,34.66 34.29,34.66 34.29,26.41 33.02,25.13 IC13.5
N$71
  Bottom 0.254: INPUT.9 20.32,38.47 21.59,39.74 21.59,42.28 16.51,47.36 4.45,47.36 4.45,32.12 21.59,32.12 21.59,26.41 20.32,25.13 IC11.5
N$72
  Bottom 0.254: INPUT.10 20.32,42.28 15.88,46.73 5.08,46.73 5.08,32.76 22.86,32.76 IC11.3
N$73
  Bottom 0.254: INPUT.11 23.13,38.74 24.13,39.74 24.13,42.28 17.78,48.63 3.17,48.63 3.17,30.85 10.79,30.85 10.79,26.41 8.26,23.86 8.26,14.97 6.99,13.7 IC10.5
N$74
  Bottom 0.254: INPUT.13 25.4,38.47 26.67,39.74 26.67,42.28 19.05,49.9 1.91,49.9 1.91,29.58 8.26,29.58 8.26,26.41 7.03,25.09 7.03,21.06 6.99,21.01 IC9.5
N$75
  Top 0.813: IC14.7 38.1,7.36 35.56,7.36 IC14.6
  Bottom 0.254: OUTPUT.3 50.12,25.77 50.12,25.72 49.53,25.13 43.18,25.13 42.55,24.5 42.55,10.53 38.1,10.53 IC14.7
N$76
  Top 0.813: IC14.1 40.64,16.88 38.1,16.88 IC14.2
  Bottom 0.254: OUTPUT.4 51.39,27.04 49.53,27.04 48.26,25.77 42.55,25.77 41.91,25.13 41.91,15.61 40.64,15.61 IC14.1
N$77
  Top 0.813: IC13.7 38.1,20.06 35.56,20.06 IC13.6
  Bottom 0.254: IC13.7 38.1,19.42 36.83,18.15 36.83,14.97 34.29,12.44 34.29,6.08 43.81,6.08 43.81,22.59 44.45,23.23 50.12,23.23 OUTPUT.5
N$78
  Top 0.813: IC13.1 40.64,29.58 38.1,29.58 IC13.2
  Bottom 0.254: OUTPUT.6 51.39,24.5 43.81,24.5 43.18,23.86 43.18,6.72 36.83,6.72 36.83,12.44 39.37,14.97 39.37,25.13 40.64,26.41 IC13.1
N$79
  Top 0.813: IC12.7 25.4,7.36 22.86,7.36 IC12.6
  Bottom 0.254: IC12.7 25.4,4.81 45.09,4.81 45.09,20.06 45.72,20.69 50.12,20.69 OUTPUT.7
N$80
  Top 0.813: IC12.1 27.94,16.88 25.4,16.88 IC12.2
  Bottom 0.254: OUTPUT.8 51.39,21.96 45.09,21.96 44.45,21.33 44.45,5.45 26.67,5.45 26.67,12.44 27.94,13.7 IC12.1
N$81
  Top 0.813: IC11.7 25.4,20.06 22.86,20.06 IC11.6
  Bottom 0.254: IC11.7 25.4,19.42 24.13,18.15 24.13,14.97 21.59,12.44 21.59,3.55 46.35,3.55 46.35,17.52 46.99,18.15 50.12,18.15 OUTPUT.9
N$82
  Top 0.813: IC11.1 27.94,29.58 25.4,29.58 IC11.2
  Bottom 0.254: OUTPUT.10 51.39,19.42 46.35,19.42 45.72,18.78 45.72,4.18 24.13,4.18 24.13,12.44 26.67,14.97 26.67,23.23 27.94,24.5 IC11.1
N$83
  Top 0.813: IC10.7 12.06,7.36 9.53,7.36 IC10.6
  Bottom 0.254: IC10.7 12.06,2.28 47.62,2.28 47.62,14.97 48.26,15.61 50.12,15.61 OUTPUT.11
N$84
  Top 0.813: IC10.1 14.61,16.88 12.06,16.88 IC10.2
  Bottom 0.254: OUTPUT.12 51.39,16.88 47.62,16.88 46.99,16.25 46.99,2.91 13.34,2.91 13.34,12.44 14.61,13.7 IC10.1
N$85
  Top 0.813: IC9.7 12.06,20.06 9.53,20.06 IC9.6
  Bottom 0.254: IC9.7 12.06,19.42 10.79,18.15 10.79,14.97 8.26,12.44 8.26,1 48.9,1 48.9,12.44 49.53,13.07 50.12,13.07 OUTPUT.13
N$86
  Top 0.813: IC9.1 14.61,29.58 12.06,29.58 IC9.2
  Bottom 0.254: OUTPUT.14 51.39,14.34 48.9,14.34 48.26,13.7 48.26,1.64 10.79,1.64 10.79,12.44 13.34,14.97 13.34,23.23 14.61,24.5 IC9.1
N$87
  Bottom 0.254: SW_IN2.13 83.19,101.97 83.82,102.61 84.45,102.61 92.71,110.86 92.71,117.84 99.06,117.84 U$12.LEFT
N$89
  Bottom 0.254: 181.61,30.22 X14.2
  Bottom 1.778: 181.61,30.22 168.28,43.55 167,43.55 TR1.4
NETZ_0V
  Bottom 0.254: 120.02,13.32 115.57,8.88 C7.1 114.68,8.88 101.35,8.88 99.57,7.1 IC2.GND | 120.02,13.32 131.57,13.32 TR1.7 | C8.1 77.34,15.1 77.34,20.44 LED2.A 76.45,20.44 66.67,20.44 64.9,22.21 64.9,39.99 74.68,39.99 | D7.A 86.23,31.99 85.34,32.88 77.34,32.88 LED1.K 76.45,32.88 76.45,37.33 C6.2 76.45,38.22 74.68,39.99 | 104.9,44.44 99.57,44.44 97.79,46.22 IC1.GND | 104.9,44.44 113.79,44.44 | 113.79,44.44 114.68,44.44 C5.2 | J3.3 69.34,24.88 69.34,26.66 J3.2 69.34,27.55 93.34,27.55 | 93.34,27.55 C4.+ 93.34,23.99 | 93.34,27.55 C3.- 93.34,29.33 100.46,29.33 104.01,32.88 C1.- 104.9,33.77 107.57,36.44 120.02,36.44 | 93.34,23.99 88.9,23.99 87.12,22.21 D8.C | 93.34,23.99 100.46,23.99 104.01,20.44 C2.+ 104.9,19.55 120.02,19.55 120.02,13.32 | 120.02,36.44 128.91,36.44 131.57,39.1 TR1.6 | 113.79,44.44 113.79,50.66 115.57,50.66 120.02,46.22 120.02,36.44 | 74.68,39.99 74.68,44.44 75.56,44.44 77.34,46.22 77.34,47.11 80.01,49.77 99.57,49.77 104.9,44.44
  pour Top (rank 6): 58,52 188,52 188,0 58,0
  pour Bottom (rank 6): 58,52 188,52 188,0 58,0
OPV_0V
  Bottom 0.254: INPUT.1 INPUT.2 10.16,37.2 31.11,37.2 31.11,42.91 40.64,42.91 J2.2 | J2.2 40.64,40.65 | 52.7,28.31 OUTPUT.2 OUTPUT.1 45.72,32.71 45.72,37.2 43.18,39.74 J2.3 J2.2
  pour Top (rank 6): 0,52 58,52 58,0 0,0
  pour Bottom (rank 6): 0,52 58,52 58,0 0,0
SCHALTER_0V
  Top 0.254: SW_IN.1 71.38,89.01 71.44,88.95 | 71.44,88.95 101.28,88.95 | 101.28,88.95 101.28,87.83 SW_OUT.2 | SW_OUT.1 101.38,90 101.28,89.91 101.28,88.95 | 71.44,88.95 71.38,88.89 SW_IN.2
  pour Top: 0,98 188,98 188,52 0,52
  pour Bottom: 0,98 188,98 188,52 0,52
(copper drawn outside any net)
  shapes: Bottom circle x1, Top area x2, Top circle x1

### Text on the board
Top: AudioBürokrat | AudioBürokrat | Emmelie v3.2 | Emmelie v3.2 | Stecker IN PCB | Stecker OUT PCB | AudioBürokrat - Emmelie v3.2 - Schalter PCB | IN | 0V | 0V | +12V | -12V | LED | + | - | 230V AC | OUT | +12V | 0V | Sekundär - Primär | 0V | -12V | AudioBürokrat | Verstärker PCB | Emmelie v3.2 | AudioBürokrat - Emmelie v3.2 | Netzteil PCB
Bottom: IN | OUT